# EAGLE design comparator (EAGLE 7.5.0)
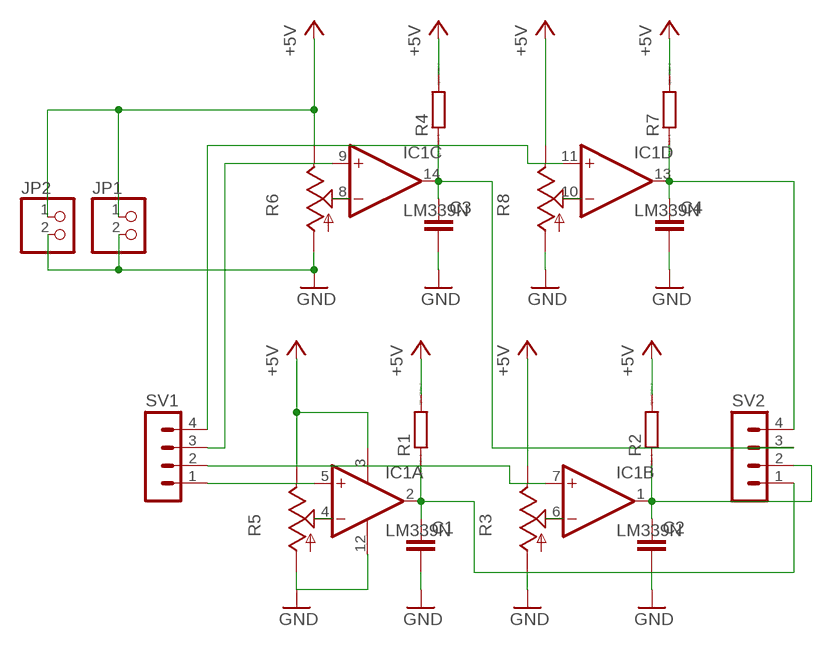
[diagram p0: schematic, sheet 1]

## Parts
C1  C-EU075-032X103  [C075-032X103]
C2  C-EU075-032X103  [C075-032X103]
C3  C-EU075-032X103  [C075-032X103]
C4  C-EU075-032X103  [C075-032X103]
IC1  LM339N  [DIL14]
JP1  PINHD-1X2  [1X02]
JP2  PINHD-1X2  [1X02]
R1  R0207/10  [0207/10]
R2  R0207/10  [0207/10]
R3  TRIM_US-RS3  [RS3]
R4  R0207/10  [0207/10]
R5  TRIM_US-RS3  [RS3]
R6  TRIM_US-RS3  [RS3]
R7  R0207/10  [0207/10]
R8  TRIM_US-RS3  [RS3]
SV1  MA04-1  [MA04-1]
SV2  MA04-1  [MA04-1]

## Nets
+5V: IC1.3(P:V+) JP1.1 JP2.1 R1.2 R2.2 R3.E R4.2 R5.E R6.E R7.2 R8.E
GND: C1.2 C2.2 C3.2 C4.2 IC1.12(P:GND) JP1.2 JP2.2 R3.A R5.A R6.A R8.A
N$1: C1.1 IC1.2(A:OUT) R1.1 SV2.1
N$2: IC1.5(A:+IN) SV1.1
N$3: C2.1 IC1.1(B:OUT) R2.1 SV2.2
N$4: IC1.6(B:-IN) R3.S
N$5: IC1.4(A:-IN) R5.S
N$6: IC1.7(B:+IN) SV1.2
N$7: C3.1 IC1.14(C:OUT) R4.1 SV2.3
N$8: IC1.8(C:-IN) R6.S
N$9: IC1.9(C:+IN) SV1.3
N$10: C4.1 IC1.13(D:OUT) R7.1 SV2.4
N$11: IC1.10(D:-IN) R8.S
N$12: IC1.11(D:+IN) SV1.4

## Library data of the parts
C1-C4 = rcl:C-EU: CAPACITOR, European symbol
IC1 = linear:LM339: Low Power Low Offset Voltage Quad Comparators with open collector; LM139/LM239/LM339/LM2901/LM3302
JP1 JP2 = pinhead:PINHD-1X2: PIN HEADER
R1 R2 R4 R7 = eagle-ltspice:R: RESISTOR, European symbol; SPICEMODEL: NONE; SPICEPREFIX: R
R3 R5 R6 R8 = pot:TRIM_US-: POTENTIOMETER
SV1 SV2 = con-lstb:MA04-1: PIN HEADER; OC_FARNELL: unknown; OC_NEWARK: unknown

## Board
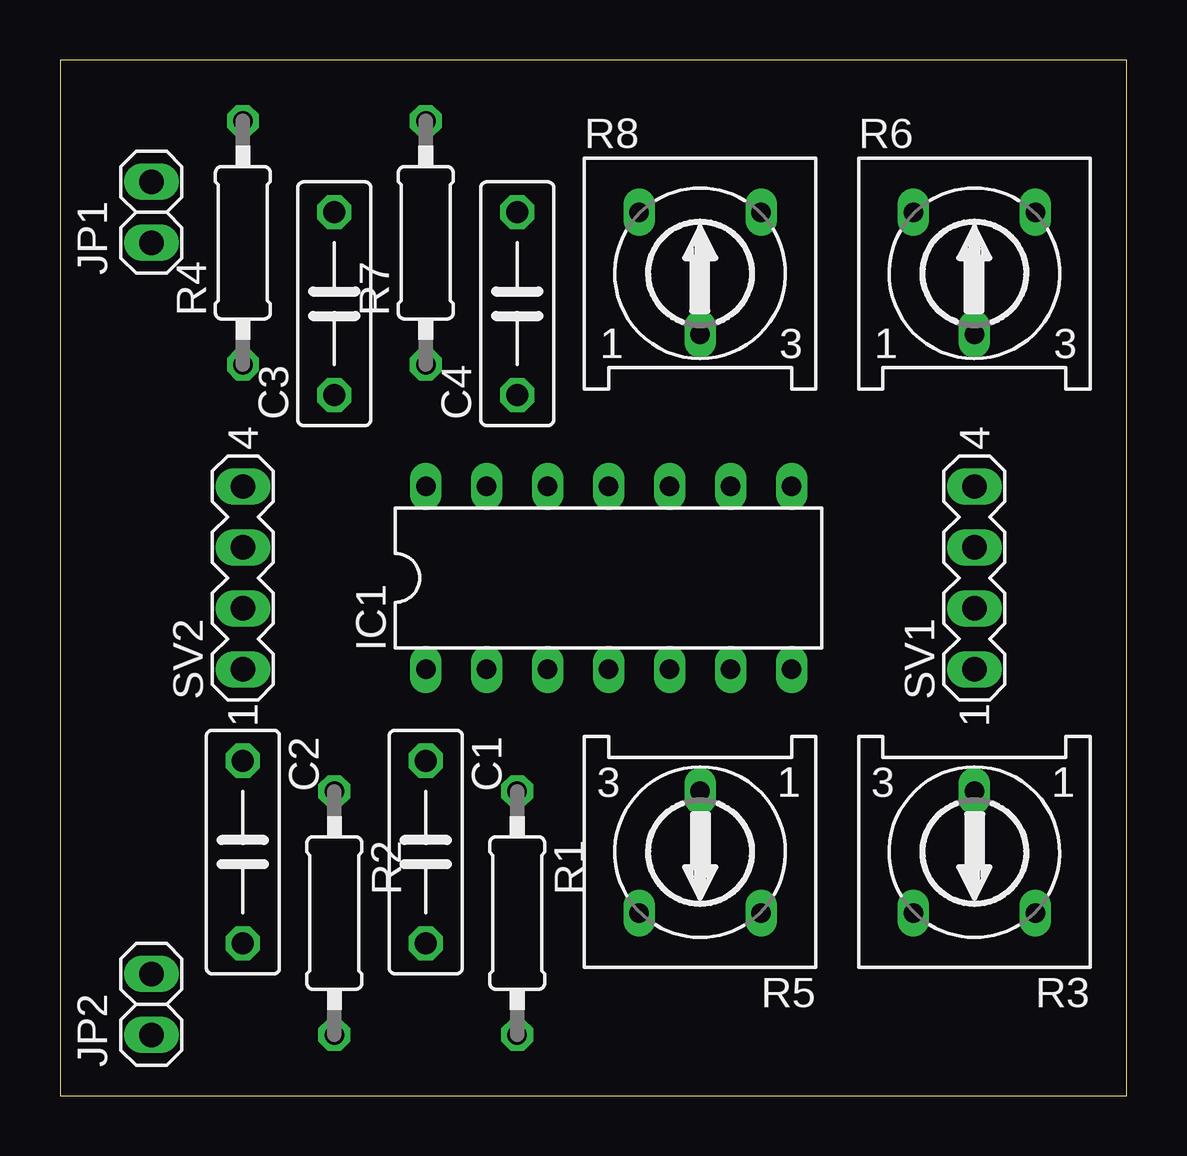
[diagram p1: board, top side]
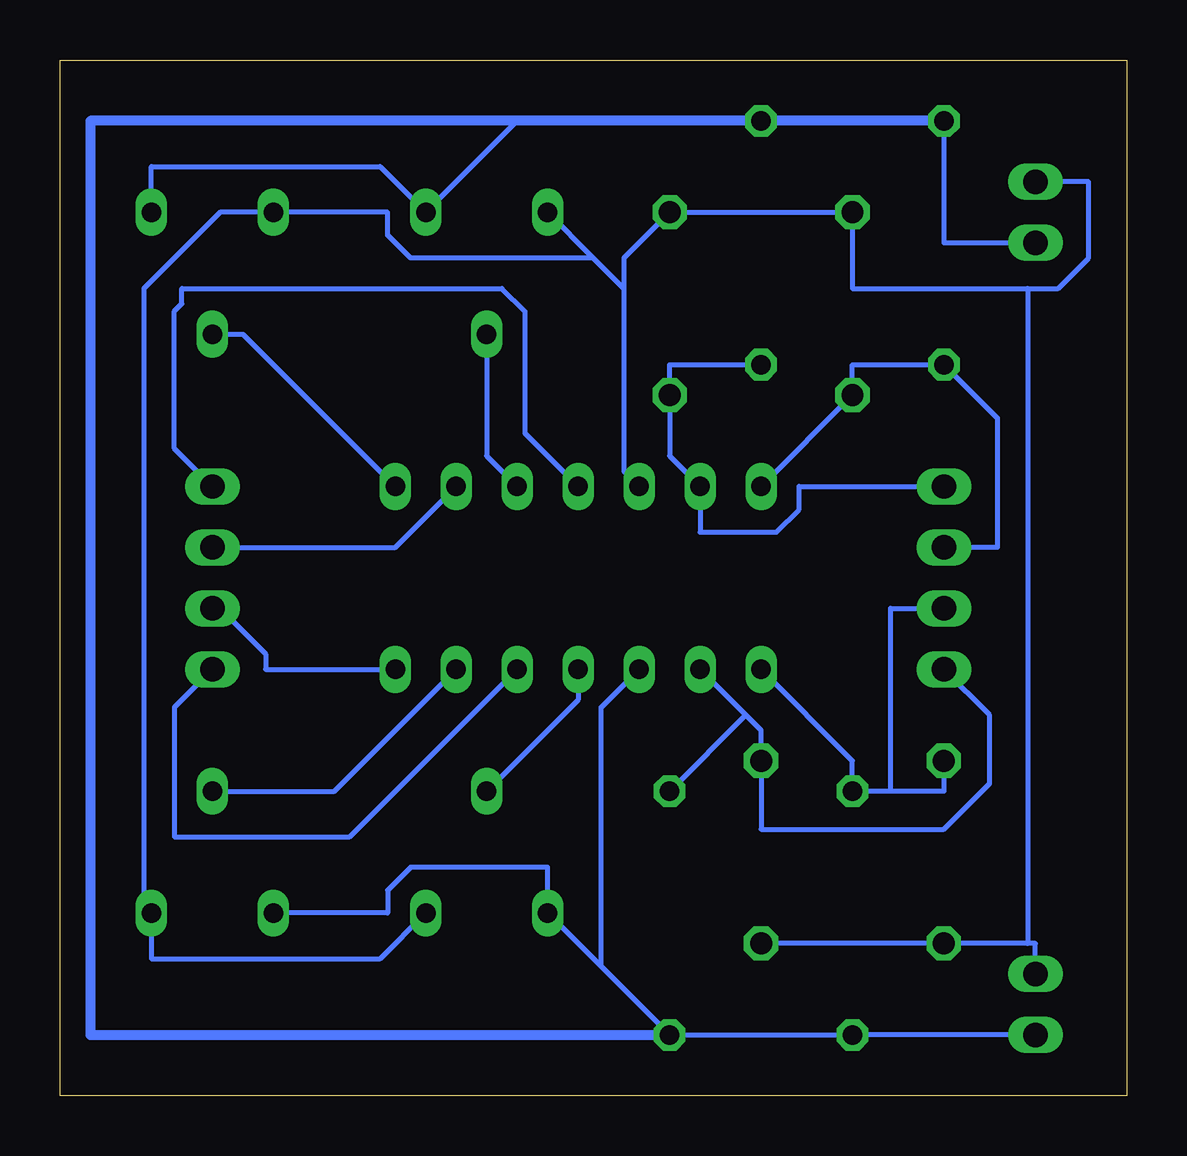
[diagram p2: board, bottom side, seen from below]

Size 44.45 x 43.18 mm. Coordinates in mm from the lower left corner, seen from the top.
Copper layers (1*16): Top 0.035mm / dielectric 1.5mm / Bottom 0.035mm
Design rules "Othermill-DRC-1-32": minimum track width 8mil, minimum drill 0.8mm, track to track 0.794003125mm, track to pad 0.794003125mm, pad to pad 0.794003125mm, via to via 0.794003125mm, smd to smd 0mil, copper to edge 0mil, drill to drill 1mil, minimum pad ring 10mil, minimum via ring 10mil, stop-mask expansion 1mil, vias tented up to drill 30mil, thermal gap 10mil

### Footprints (pad centres in the part's own frame; a part is rotated, then mirrored left to right if it is on the bottom)
C075-032X103 = drill 0.914 octagon: 1 -3.81,0; 2 3.81,0
DIL14 = drill 0.813 long: 1 -7.62,-3.81; 2 -5.08,-3.81; 3 -2.54,-3.81; 4 0,-3.81; 5 2.54,-3.81; 6 5.08,-3.81; 7 7.62,-3.81; 8 7.62,3.81; 9 5.08,3.81; 10 2.54,3.81; 11 0,3.81; 12 -2.54,3.81; 13 -5.08,3.81; 14 -7.62,3.81
1X02 = drill 1.016 long: 1 -1.27,0; 2 1.27,0
0207/10 = drill 0.813 octagon: 1 -5.08,0; 2 5.08,0
RS3 = drill 0.813 long: A -2.54,2.54; E 2.54,2.54; S 0,-2.54
MA04-1 = drill 1.016 long: 1 -3.81,0; 2 -1.27,0; 3 1.27,0; 4 3.81,0

### Placement (x,y rotation side)
C1  15.24,10.16 270 top
C2  7.62,10.16 270 top
C3  11.43,33.02 90 top
C4  19.05,33.02 90 top
IC1  22.86,21.59 0 top
JP1  3.81,36.83 90 top
JP2  3.81,3.81 90 top
R1  19.05,7.62 270 top
R2  11.43,7.62 270 top
R3  38.1,10.16 180 top
R4  7.62,35.56 90 top
R5  26.67,10.16 180 top
R6  38.1,34.29 0 top
R7  15.24,35.56 90 top
R8  26.67,34.29 0 top
SV1  38.1,21.59 90 top
SV2  7.62,21.59 90 top

### Tracks (layer width: path | path; a pad name or v marks a point on that pad's centre or on a via)
+5V
  Bottom 0.203: R6.E 40.64,38.73 31.12,38.73 R8.E 25.4,40.64 R7.2 R4.2 7.62,35.56 JP1.1 | 21.91,5.4 R5.E 24.13,9.52 29.84,9.52 30.8,8.57 30.8,7.62 R3.E | 21.91,5.4 R1.2 R2.2 JP2.1 3.49,2.54 | IC1.3 21.91,16.19 21.91,5.4
  Bottom 0.406: R4.2 43.18,40.64 43.18,2.54 R1.2
GND
  Bottom 0.203: 4.13,6.35 3.81,6.35 JP2.2 | 4.13,6.35 C2.2 C1.2 | R5.A 31.12,5.71 40.64,5.71 R3.A 40.96,7.94 40.96,33.65 37.78,36.83 R6.A 30.8,36.83 30.8,35.88 29.84,34.92 22.23,34.92 | IC1.12 20.95,26.03 20.95,33.65 | 20.95,33.65 20.95,34.92 C4.2 C3.2 11.43,33.65 4.13,33.65 | 20.95,33.65 22.23,34.92 | 22.23,34.92 R8.A | JP1.2 1.59,38.1 1.59,34.92 2.86,33.65 4.13,33.65 | 4.13,33.65 4.13,6.35
N$1
  Bottom 0.203: 15.87,15.87 15.24,15.24 C1.1 15.24,11.11 7.62,11.11 5.71,13.02 5.71,15.87 SV2.1 | 15.87,15.87 IC1.2 | 15.87,15.87 R1.1
N$2
  Bottom 0.203: IC1.5 32.38,10.79 39.69,10.79 39.69,16.19 SV1.1
N$3
  Bottom 0.203: 9.84,12.7 7.62,12.7 C2.1 | 9.84,12.7 R2.1 11.43,13.97 IC1.1 | SV2.2 9.84,20.32 9.84,12.7
N$4
  Bottom 0.203: IC1.6 33.02,12.7 R3.S
N$5
  Bottom 0.203: R5.S 22.86,16.51 IC1.4
N$6
  Bottom 0.203: IC1.7 35.88,17.78 35.88,18.41 37.78,20.32 SV1.2
N$7
  Bottom 0.203: IC1.14 C3.1 11.43,30.48 R4.1 5.4,28.26 5.4,22.86 SV2.3
N$8
  Bottom 0.203: IC1.8 36.83,31.75 R6.S
N$9
  Bottom 0.203: IC1.9 30.48,22.86 SV1.3
N$10
  Bottom 0.203: R7.1 19.05,30.48 C4.1 19.05,26.67 IC1.13 17.78,23.49 14.6,23.49 13.65,24.45 13.65,25.4 SV2.4
N$11
  Bottom 0.203: IC1.10 26.67,26.67 R8.S
N$12
  Bottom 0.203: IC1.11 25.08,27.62 25.08,32.7 26.03,33.65 39.37,33.65 39.37,33.02 39.69,32.7 39.69,26.99 SV1.4